# Altium schematic sheet XTIDA-010086_Power Stage.SchDoc: Power Stage (part 1 of 3)
size 558 x 431 mm; Date: Not shown in title block; ApprovedBy: Not shown in title block; CheckedBy: Not shown in title block; Author: Not shown in title block; CompanyName: Not shown in title block; DrawnBy: Jeff Xie; Engineer: Not shown in title block; Organization: Not shown in title block; Address1: Not shown in title block; Address2: Not shown in title block; Address3: Not shown in title block; Address4: Not shown in title block; DocumentNumber: 2; Revision: Use project parameter SCH_Rev; SheetNumber: 4; SheetTotal: 8; PageSetup: Record=PageOptions|CenterHorizontal=True|CenterVertical=True|PrintScale=1.00|XCorrection=1.00|YCorrection=1.00|PrintKind=0|BorderSize=5000000|LeftOffset=0|BottomOffset=0|Orientation=2|PaperLength=1000|PaperWidth=1000|Scale=100|PaperSource=15|PrintQuality=600|MediaType=1|DitherType=10|PaperKind=Letter|PrintScaleMode=1; CurrentTime: Not shown in title block; CurrentDate: Not shown in title block; Time: Not shown in title block; DocumentFullPathAndName: Not shown in title block; DocumentName: Not shown in title block; ModifiedDate: Not shown in title block; ImagePath: Not shown in title block
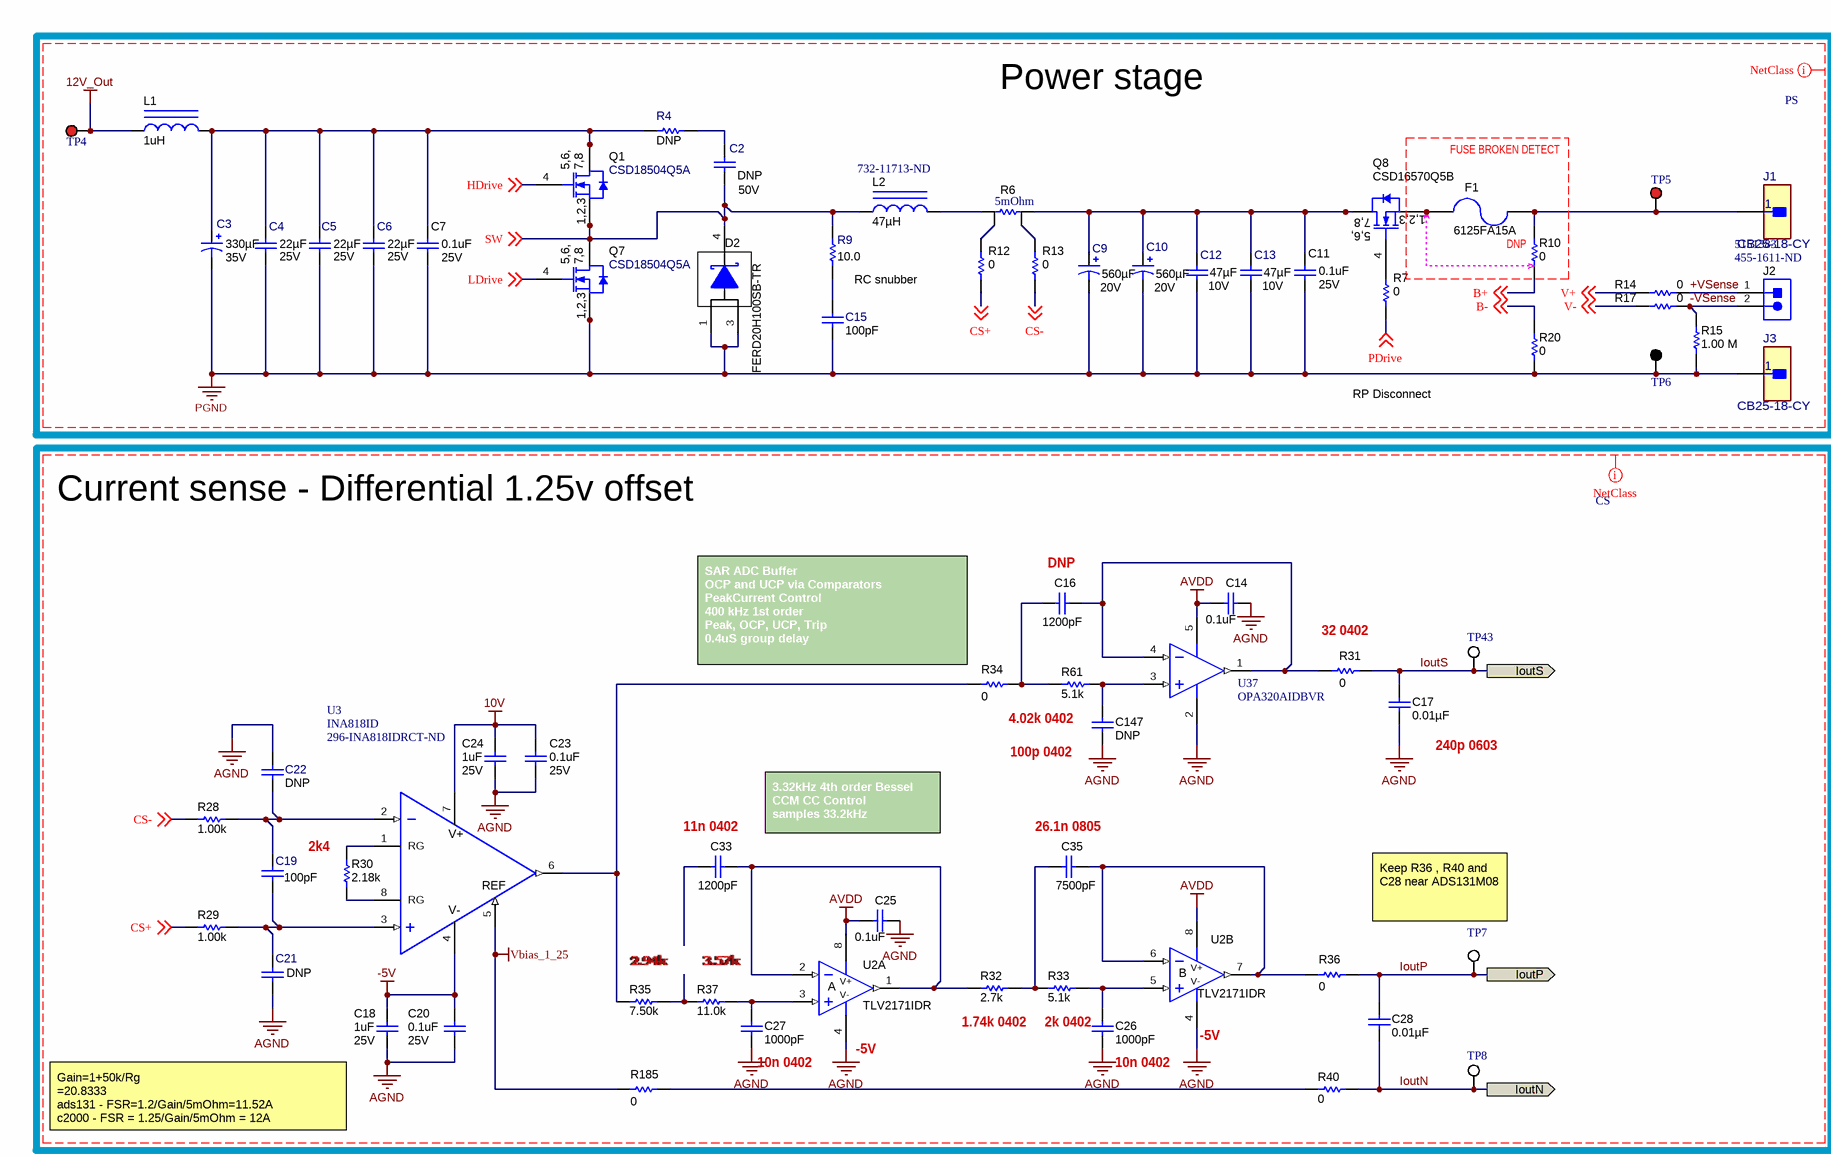
[diagram p0: XTIDA-010086_Power Stage.SchDoc, top left]
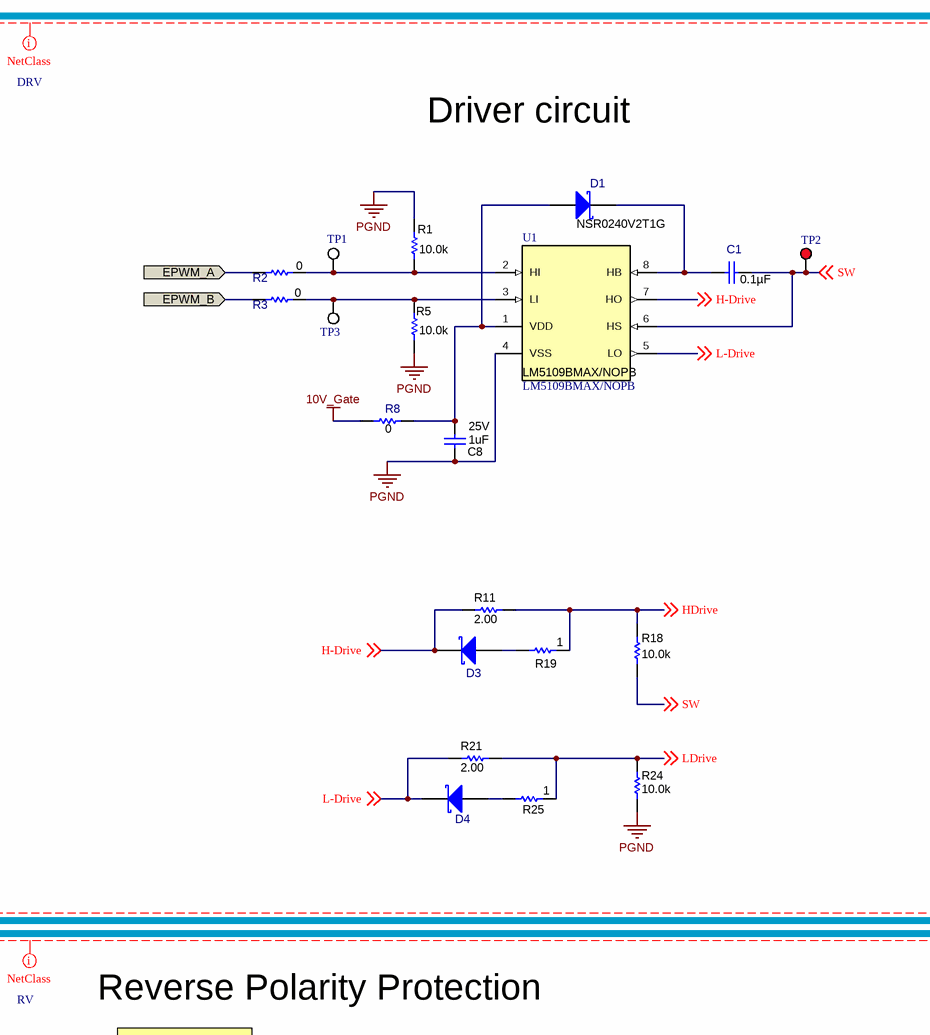
[diagram p1: XTIDA-010086_Power Stage.SchDoc, top right]
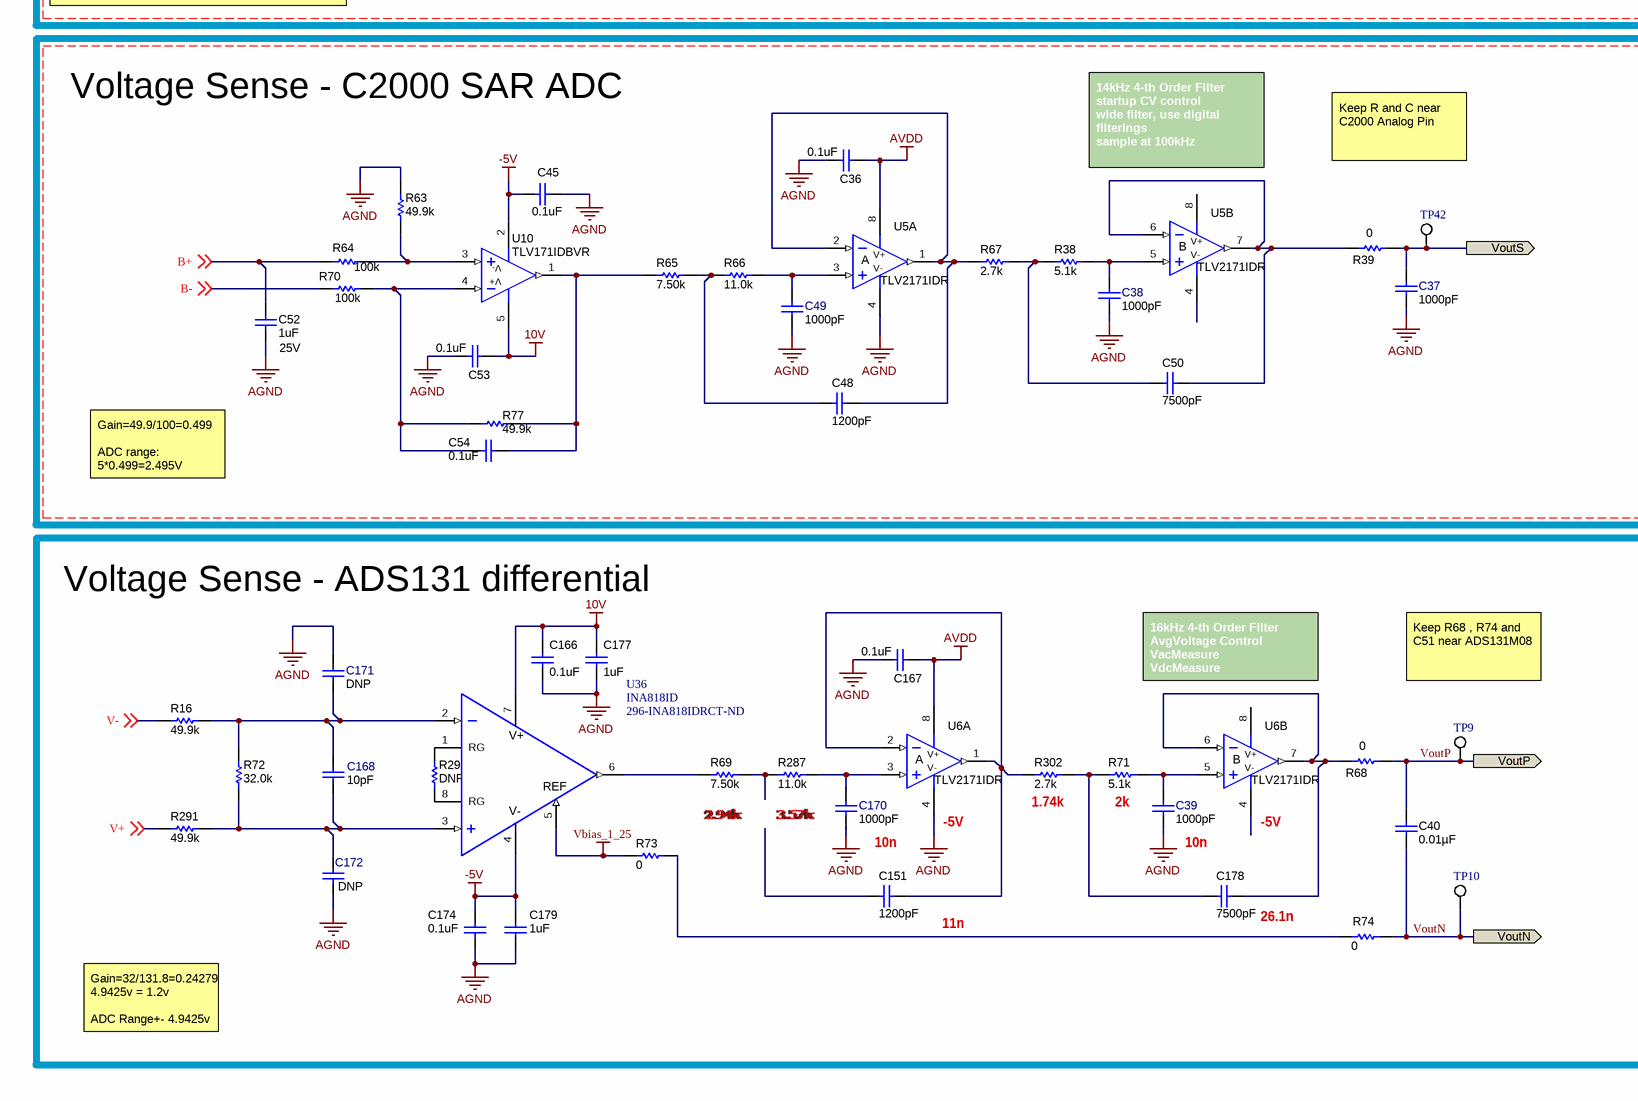
[diagram p2: XTIDA-010086_Power Stage.SchDoc, bottom left]
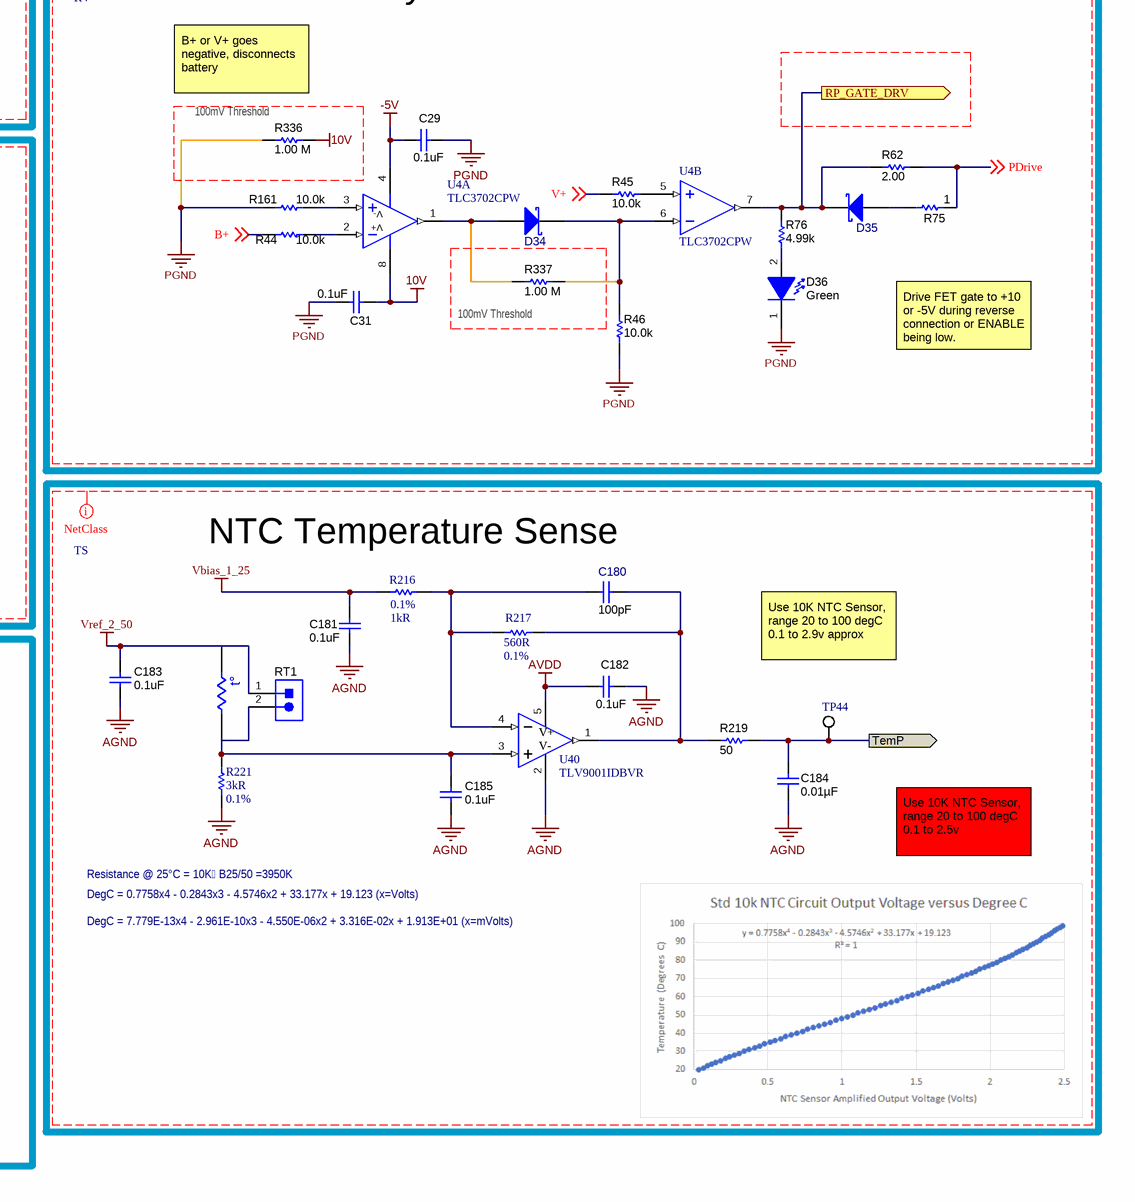
[diagram p3: XTIDA-010086_Power Stage.SchDoc, bottom right]

## Parts
(Parts that share a designator on the sheet are numbered #1, #2 ... from top to bottom, then left to right.)
C1  ValueDisplayed: 0.1µF  [0603L]  (hidden comment: C0603C104J3RACTU)
C2  ValueDisplayed: DNP  Value2: 50V  [0603L]  (hidden comment: GRM1885C1H101JA01D)
C3  ValueDisplayed: 330µF  Value2: 35V  [CAPSMT_62_F12]  (hidden comment: 35SVPK330M)
C4  ValueDisplayed: 22µF  Value2: 25V  [1210_270]  (hidden comment: GRM32ER71E226KE15L)
C5  ValueDisplayed: 22µF  Value2: 25V  [1210_270]  (hidden comment: GRM32ER71E226KE15L)
C6  ValueDisplayed: 22µF  Value2: 25V  [1210_270]  (hidden comment: GRM32ER71E226KE15L)
C7  ValueDisplayed: 0.1uF  Value2: 25V  [0603]  (hidden comment: 06033C104JAT2A)
C8  ValueDisplayed: 1uF  VDC_V: 25V  [0603]  (hidden comment: GRM188R71E105KA12D)
C9  ValueDisplayed: 560µF  Value2: 20V  [SM_RADIAL_10AMM]  (hidden comment: 20SVF560M)
C10  ValueDisplayed: 560µF  Value2: 20V  [SM_RADIAL_10AMM]  (hidden comment: 20SVF560M)
C11  ValueDisplayed: 0.1uF  Value2: 25V  [0603]  (hidden comment: 06033C104JAT2A)
C12  ValueDisplayed: 47µF  Value2: 10V  [1210_270]  (hidden comment: GRM32ER71A476ME15L)
C13  ValueDisplayed: 47µF  Value2: 10V  [1210_270]  (hidden comment: GRM32ER71A476ME15L)
C14  ValueDisplayed: 0.1uF  [0603]  (hidden comment: 06033C104JAT2A)
C15  ValueDisplayed: 100pF  [0603L]  (hidden comment: GRM1885C1H101JA01D)
C16  ValueDisplayed: 1200pF  [0402]  (hidden comment: GRM155R71H122KA01D)
C17  ValueDisplayed: 0.01µF  [0603]  (hidden comment: C0603C103J3GECAUTO)
C18  ValueDisplayed: 1uF  VDC_V: 25V  [0603]  (hidden comment: GRM188R71E105KA12D)
C19  ValueDisplayed: 100pF  [0603L]  (hidden comment: GRM1885C1H101JA01D)
C20  ValueDisplayed: 0.1uF  Value2: 25V  [0603]  (hidden comment: 06033C104JAT2A)
C21  value DNP  [0603L]  (hidden comment: GRM1885C1H101JA01D)
C22  value DNP  [0603L]  (hidden comment: GRM1885C1H101JA01D)
C23  ValueDisplayed: 0.1uF  Value2: 25V  [0603]  (hidden comment: 06033C104JAT2A)
C24  ValueDisplayed: 1uF  Value2: 25V  [0603]  (hidden comment: GRM188R71E105KA12D)
C25  ValueDisplayed: 0.1uF  [0603]  (hidden comment: 06033C104JAT2A)
C26  ValueDisplayed: 1000pF  [0402]  (hidden comment: 885012205044)
C27  ValueDisplayed: 1000pF  [0402]  (hidden comment: 885012205044)
C28  ValueDisplayed: 0.01µF  [0603]  (hidden comment: C0603C103J3GECAUTO)
C29  ValueDisplayed: 0.1uF  [0603]  (hidden comment: 06033C104JAT2A)
C31  ValueDisplayed: 0.1uF  [0603]  (hidden comment: 06033C104JAT2A)
C33  ValueDisplayed: 1200pF  [0402]  (hidden comment: GRM155R71H122KA01D)
C35  ValueDisplayed: 7500pF  [0805_HV]  (hidden comment: GRM2195C1H752JA01D)
C36  ValueDisplayed: 0.1uF  [0603]  (hidden comment: 06033C104JAT2A)
C37  ValueDisplayed: 1000pF  [0603L]  (hidden comment: GRM1885C1H102JA01D)
C38  ValueDisplayed: 1000pF  [0603L]  (hidden comment: GRM1885C1H102JA01D)
C39  ValueDisplayed: 1000pF  [0603L]  (hidden comment: GRM1885C1H102JA01D)
C40  ValueDisplayed: 0.01µF  [0603]  (hidden comment: C0603C103J3GECAUTO)
C45  ValueDisplayed: 0.1uF  [0603]  (hidden comment: 06033C104JAT2A)
C48  ValueDisplayed: 1200pF  [0402]  (hidden comment: GRM155R71H122KA01D)
C49  ValueDisplayed: 1000pF  [0603L]  (hidden comment: GRM1885C1H102JA01D)
C50  ValueDisplayed: 7500pF  [0805_HV]  (hidden comment: GRM2195C1H752JA01D)
C52  ValueDisplayed: 1uF  Value2: 25V  [0603]  (hidden comment: GRM188R71E105KA12D)
C53  ValueDisplayed: 0.1uF  [0603]  (hidden comment: 06033C104JAT2A)
C54  value 0.1uF  [0603]  (hidden comment: 06033C104JAT2A)
C147  ValueDisplayed: DNP  [0402]  (hidden comment: GRM155R71H122KA01D)
C151  ValueDisplayed: 1200pF  [0402]  (hidden comment: GRM155R71H122KA01D)
C166  ValueDisplayed: 0.1uF  [0603]  (hidden comment: 06033C104JAT2A)
C167  ValueDisplayed: 0.1uF  [0603]  (hidden comment: 06033C104JAT2A)
C168  ValueDisplayed: 10pF  [0603L]  (hidden comment: GRM1885C1H100JA01D)
C170  ValueDisplayed: 1000pF  [0603L]  (hidden comment: GRM1885C1H102JA01D)
C171  value DNP  [0603L]  (hidden comment: GRM1885C1H101JA01D)
C172  value DNP  [0603L]  (hidden comment: GRM1885C1H101JA01D)
C174  ValueDisplayed: 0.1uF  [0603]  (hidden comment: 06033C104JAT2A)
C177  ValueDisplayed: 1uF  [0603]  (hidden comment: GRM188R71E105KA12D)
C178  ValueDisplayed: 7500pF  [0805_HV]  (hidden comment: GRM2195C1H752JA01D)
C179  ValueDisplayed: 1uF  [0603]  (hidden comment: GRM188R71E105KA12D)
C180  ValueDisplayed: 100pF  [0603L]  (hidden comment: GRM1885C1H101JA01D)
C181  ValueDisplayed: 0.1uF  [0603]  (hidden comment: 06033C104JAT2A)
C182  ValueDisplayed: 0.1uF  [0603]  (hidden comment: 06033C104JAT2A)
C183  ValueDisplayed: 0.1uF  [0603]  (hidden comment: 06033C104JAT2A)
C184  ValueDisplayed: 0.01µF  [0603]  (hidden comment: C0603C103J3GECAUTO)
C185  ValueDisplayed: 0.1uF  [0603]  (hidden comment: 06033C104JAT2A)
D1  NSR0240V2T1G  [SOD-523]
D2  FERD20H100SB-TR  [DPAK]
D3  NSR0240V2T1G  [SOD-523]  (value not drawn)
D4  NSR0240V2T1G  [SOD-523]  (value not drawn)
D34  NSR0240V2T1G  [SOD-523]  (value not drawn)
D35  NSR0240V2T1G  [SOD-523]  (value not drawn)
D36  value Green  [WL-SMCW_GREEN]  (hidden comment: 150060VS75000)
F1  6125FA15A  [6125FA]
J1  CB25-18-CY  [FP-CB25-18-CY_CONN_TERM_LUG_25MM4_7MM9-MFG]
J2  Supplier Part Number 1: 455-1611-ND  Supplier Part Number 2: 5151383  [JST_B2B-EH-A]  (hidden comment: B2B-EH-A(LF)(SN))
J3  CB25-18-CY  [FP-CB25-18-CY_CONN_TERM_LUG_25MM4_7MM9-MFG]
L1  ValueDisplayed: 1uH  [WE-LHMI_4020]  (hidden comment: 74437324010)
L2  ValueDisplayed: 47µH  Supplier Part Number 1: 732-11713-ND  [WE-HCF Round_2920]  (hidden comment: 74437529203470)
Q1  CSD18504Q5A  [DQJ0008A]
Q7  CSD18504Q5A  [DQJ0008A]
Q8  CSD16570Q5B  [DNK0008A]
R1  ValueDisplayed: 10.0k  [0603]  (hidden comment: RC0603FR-0710KL)
R2  ValueDisplayed: 0  [0603L]  (hidden comment: RC0603JR-070RL)
R3  ValueDisplayed: 0  [0603L]  (hidden comment: RC0603JR-070RL)
R4  ValueDisplayed: DNP  [1206L]  (hidden comment: RC1206FR-0710RL)
R5  ValueDisplayed: 10.0k  [0603]  (hidden comment: RC0603FR-0710KL)
R6  ValueDisplayed: 5mOhm  [CSM3637Z]  (hidden comment: Y14880R00500B9R)
R7  ValueDisplayed: 0  [0402]  (hidden comment: CRCW04020000Z0ED)
R8  ValueDisplayed: 0  [0603L]  (hidden comment: RC0603JR-070RL)
R9  ValueDisplayed: 10.0  [1206L]  (hidden comment: RC1206FR-0710RL)
R10  ValueDisplayed: 0  [0402]  (hidden comment: CRCW04020000Z0ED)
R11  ValueDisplayed: 2.00  [0603]  (hidden comment: CRCW06032R00FKEA)
R12  ValueDisplayed: 0  [0402]  (hidden comment: CRCW04020000Z0ED)
R13  ValueDisplayed: 0  [0402]  (hidden comment: CRCW04020000Z0ED)
R14  ValueDisplayed: 0  [0402]  (hidden comment: CRCW04020000Z0ED)
R15  ValueDisplayed: 1.00 M  [0603]  (hidden comment: CRCW06031M00FKEA)
R16  ValueDisplayed: 49.9k  [0603]  (hidden comment: CRCW060349K9FKEA)
R17  ValueDisplayed: 0  [0402]  (hidden comment: CRCW04020000Z0ED)
R18  ValueDisplayed: 10.0k  [0603]  (hidden comment: RC0603FR-0710KL)
R19  ValueDisplayed: 1  [0603]  (hidden comment: RC0603FR-071RL)
R20  ValueDisplayed: 0  [0402]  (hidden comment: CRCW04020000Z0ED)
R21  ValueDisplayed: 2.00  [0603]  (hidden comment: CRCW06032R00FKEA)
R24  ValueDisplayed: 10.0k  [0603]  (hidden comment: RC0603FR-0710KL)
R25  ValueDisplayed: 1  [0603]  (hidden comment: RC0603FR-071RL)
R28  ValueDisplayed: 1.00k  [0603]  (hidden comment: RG1608P-102-B-T5)
R29  ValueDisplayed: 1.00k  [0603]  (hidden comment: RG1608P-102-B-T5)
R30  ValueDisplayed: 2.18k  [0603]  (hidden comment: RT0603BRD072K18L)
R31  ValueDisplayed: 0  [0402]  (hidden comment: CRCW04020000Z0ED)
R32  ValueDisplayed: 2.7k  [0402]  (hidden comment: CRCW04022K70JNED)
R33  ValueDisplayed: 5.1k  [0402]  (hidden comment: CRCW04025K10JNED)
R34  ValueDisplayed: 0  [0402]  (hidden comment: CRCW04020000Z0ED)
R35  ValueDisplayed: 7.50k  [0402]  (hidden comment: CRCW04027K50FKED)
R36  ValueDisplayed: 0  [0402]  (hidden comment: CRCW04020000Z0ED)
R37  ValueDisplayed: 11.0k  [0402]  (hidden comment: CRCW040211K0FKED)
R38  ValueDisplayed: 5.1k  [0402]  (hidden comment: CRCW04025K10JNED)
R39  ValueDisplayed: 0  [0402]  (hidden comment: CRCW04020000Z0ED)
R40  ValueDisplayed: 0  [0402]  (hidden comment: CRCW04020000Z0ED)
R44  ValueDisplayed: 10.0k  [0603]  (hidden comment: RC0603FR-0710KL)
R45  ValueDisplayed: 10.0k  [0603]  (hidden comment: RC0603FR-0710KL)
R46  ValueDisplayed: 10.0k  [0603]  (hidden comment: RC0603FR-0710KL)
R61  ValueDisplayed: 5.1k  [0402]  (hidden comment: CRCW04025K10JNED)
R62  ValueDisplayed: 2.00  [0603]  (hidden comment: CRCW06032R00FKEA)
R63  ValueDisplayed: 49.9k  [0603]  (hidden comment: CRCW060349K9FKEA)
R64  ValueDisplayed: 100k  [0603]  (hidden comment: RT0603BRD07100KL)
R65  ValueDisplayed: 7.50k  [0402]  (hidden comment: CRCW04027K50FKED)
R66  ValueDisplayed: 11.0k  [0402]  (hidden comment: CRCW040211K0FKED)
R67  ValueDisplayed: 2.7k  [0402]  (hidden comment: CRCW04022K70JNED)
R68  ValueDisplayed: 0  [0402]  (hidden comment: CRCW04020000Z0ED)
R69  ValueDisplayed: 7.50k  [0402]  (hidden comment: CRCW04027K50FKED)
R70  ValueDisplayed: 100k  [0603]  (hidden comment: RT0603BRD07100KL)
R71  ValueDisplayed: 5.1k  [0402]  (hidden comment: CRCW04025K10JNED)
R72  ValueDisplayed: 32.0k  [0603]  (hidden comment: RN731JTTD3202B25)
R73  ValueDisplayed: 0  [0402]  (hidden comment: CRCW04020000Z0ED)
R74  ValueDisplayed: 0  [0402]  (hidden comment: CRCW04020000Z0ED)
R75  ValueDisplayed: 1  [0603]  (hidden comment: RC0603FR-071RL)
R76  ValueDisplayed: 4.99k  [0603L]  (hidden comment: CRCW06034K99FKEA)
R77  ValueDisplayed: 49.9k  [0603]  (hidden comment: CRCW060349K9FKEA)
R161  ValueDisplayed: 10.0k  [0603]  (hidden comment: RC0603FR-0710KL)
R185  ValueDisplayed: 0  [0402]  (hidden comment: CRCW04020000Z0ED)
R216  Tolerance: 0.1%  Resistance: 1kR  [RESC1608X55X25ML10T15]  (hidden comment: RT0603BRE071KL)
R217  Resistance: 560R  Tolerance: 0.1%  [RESC1608X55X25LL10T15]  (hidden comment: RT0603BRD07560RL)
R219  ValueDisplayed: 50  [0402]  (hidden comment: FC0402E50R0BST1)
R221  Resistance: 3kR  Tolerance: 0.1%  [RESC1608X55X30NL20T20]  (hidden comment: ERA-3YEB302V)
R287  ValueDisplayed: 11.0k  [0402]  (hidden comment: CRCW040211K0FKED)
R290  ValueDisplayed: DNP  [0402]  (hidden comment: CRCW04020000Z0ED)
R291  ValueDisplayed: 49.9k  [0603]  (hidden comment: CRCW060349K9FKEA)
R302  ValueDisplayed: 2.7k  [0402]  (hidden comment: CRCW04022K70JNED)
R336  ValueDisplayed: 1.00 M  [0603]  (hidden comment: CRCW06031M00FKEA)
R337  ValueDisplayed: 1.00 M  [0603]  (hidden comment: CRCW06031M00FKEA)
RT1#1  B2B-EH-A(LF)(SN)  [JST_B2B-EH-A]  (value not drawn)
RT1#2  Res Thermal  [JST_B2B-EH-A]  (value not drawn)  (graphical)
TP1  5002  [Keystone5002]  (value not drawn)
TP2  5000  [Keystone5000]  (value not drawn)
TP3  5002  [Keystone5002]  (value not drawn)
TP4  5000  [Keystone5000]  (value not drawn)
TP5  5000  [Keystone5000]  (value not drawn)
TP6  5001  [Keystone5001]  (value not drawn)
TP7  5002  [Keystone5002]  (value not drawn)
TP8  5002  [Keystone5002]  (value not drawn)
TP9  5002  [Keystone5002]  (value not drawn)
TP10  5002  [Keystone5002]  (value not drawn)
TP42  5002  [Keystone5002]  (value not drawn)
TP43  5002  [Keystone5002]  (value not drawn)
TP44  5002  [Keystone5002]  (value not drawn)
U1  LM5109BMAX/NOPB  [D0008A_N]
U2  TLV2171IDR  [D0008A_N]  (parts A,B of 2)
U3  INA818ID  Supplier Part Number 1: 296-INA818IDRCT-ND  [SOIC-8_TEX]
U4  TLC3702CPW  [PW8-L]  (parts A,B of 2)
U5  TLV2171IDR  [D0008A_N]  (parts A,B of 2)
U6  TLV2171IDR  [D0008A_N]  (parts A,B of 2)
U10  TLV171IDBVR  [DBV0005A_N]
U36  INA818ID  Supplier Part Number 1: 296-INA818IDRCT-ND  [SOIC-8_TEX]
U37  OPA320AIDBVR  [DBV0005A_L]
U40  TLV9001IDBVR  [DBV0005A_L]

## Blocks framed on the sheet
Power stage: C2-C7 C9-C13 C15 D2 F1 J1-J3 L1 L2 Q1 Q7 Q8 R4 R6 R7 R9 R10 R12-R15 R17 R20 TP4-TP6
Driver circuit: C1 C8 D1 D3 D4 R1-R3 R5 R8 R11 R18 R19 R21 R24 R25 TP1-TP3 U1
Current sense - Differential 1.25v offset: C14 C16-C28 C33 C35 C147 R28-R37 R40 R61 R185 TP7 TP8 TP43 U2 U3 U37
Reverse Polarity Protection: C29 C31 D34-D36 R44-R46 R62 R75 R76 R161 R336 R337 U4
Voltage Sense - C2000 SAR ADC: C36-C38 C45 C48-C50 C52-C54 R38 R39 R63-R67 R70 R77 TP42 U5 U10
NTC Temperature Sense: C180-C185 R216 R217 R219 R221 RT1#1 RT1#2 TP44 U40
Voltage Sense - ADS131 differential: C39 C40 C151 C166-C168 C170-C172 C174 C177-C179 R16 R68 R69 R71-R74 R287 R290 R291 R302 TP9 TP10 U6 U36

## Ports
EPWM_A (in), EPWM_B (in), IoutN (out), IoutP (out), IoutS (out), RP_GATE_DRV (out), TemP (out), VoutN (out), VoutP (out), VoutS (out)

## Nets
10V: C23.1 C24.1 C31.1 C53.1 C166.1 C177.1 R336.2 U3.7(V+) U4.8(VDD) U10.5(V+) U36.7(V+)
10V_Gate: R8.2
12V_Out: L1.1 TP4.1
-5V: C18.1 C20.1 C29.1 C45.1 C174.1 C179.1 U3.4(V-) U4.4(GND) U10.2(V-) U36.4(V-)
AGND: C14.2 C17.2 C18.2 C20.2 C21.1 C22.2 C23.2 C24.2 C25.2 C26.2 C27.2 C36.2 C37.1 C38.1 C39.1 C45.2 C49.1 C52.2 C53.2 C147.2 C166.2 C167.2 C170.1 C171.2 C172.2 C174.2 C177.2 C179.2 C181.1 C182.2 C183.1 C184.2 C185.1 R63.2 R221.1 U2.4(V-) U5.4(V-) U6.4(V-) U37.2(V-) U40.2(V-)
AVDD: C14.1 C25.1 C36.1 C167.1 C182.1 U2.8(V+) U5.8(V+) U6.8(V+) U37.5(V+) U40.5(V+)
PGND: C3.2(-) C4.2 C5.2 C6.2 C7.2 C8.1 C9.2(-) C10.2(-) C11.2 C12.2 C13.2 C15.1 C29.2 C31.2 D2.1(A) D2.3(A) D36.1(K) J3.1 Q7.1(S) Q7.2(S) Q7.3(S) R1.2 R5.1 R15.2 R20.1 R24.1 R46.2 R161.2 R336.1 TP6.1 U1.4(VSS)
Vbias_1_25: C181.2 R73.2 R185.2 R216.1 U3.5(REF) U36.5(REF)
Vref_2_50: C183.2 RT1#1.1 RT1#2.1
+VSense: J2.1 R14.2
-VSense: J2.2 R15.1 R17.2
B+: C52.1 R10.1 R44.2 R64.1 ; off-sheet B+
B-: R20.2 R70.1 ; off-sheet B-
CS+: R12.1 R29.1 ; off-sheet CS+
CS-: R13.1 R28.1 ; off-sheet CS-
EPWM_A: R2.2 ; port EPWM_A
EPWM_B: R3.2 ; port EPWM_B
H-Drive: D3.1(K) R11.2 U1.7(HO) ; off-sheet H-Drive
HDrive: Q1.4(G) R11.1 R18.2 R19.2 ; off-sheet HDrive
IoutN: C28.2 R40.1 TP8.1 ; port IoutN
IoutP: C28.1 R36.2 TP7.1 ; port IoutP
IoutS: C17.1 R31.2 TP43.1 ; port IoutS
L-Drive: D4.1(K) R21.2 U1.5(LO) ; off-sheet L-Drive
LDrive: Q7.4(G) R21.1 R24.2 R25.2 ; off-sheet LDrive
PDrive: R7.1 R62.1 R75.2 ; off-sheet PDrive
RP_GATE_DRV: D35.1(K) R62.2 R76.1 U4.7(2OUT) ; port RP_GATE_DRV
SW: C1.2 C2.1 D2.4(K) L2.1 Q1.1(S) Q1.2(S) Q1.3(S) Q7.5(D) Q7.6(D) Q7.7(D) Q7.8(D) Q7.9(D) R9.1 R18.1 TP2.1 U1.6(HS) ; off-sheet SW
TemP: C184.1 R219.2 TP44.1 ; port TemP
V+: R14.1 R45.2 R291.2 ; off-sheet V+
V-: R16.2 R17.1 ; off-sheet V-
VoutN: C40.2 R74.1 TP10.1 ; port VoutN
VoutP: C40.1 R68.2 TP9.1 ; port VoutP
VoutS: C37.2 R39.2 TP42.1 ; port VoutS
NetC1_1: C1.1 D1.1(K) U1.8(HB)
NetC2_2: C2.2 R4.2
NetC3_1: C3.1(+) C4.1 C5.1 C6.1 C7.1 L1.2 Q1.5(D) Q1.6(D) Q1.7(D) Q1.8(D) Q1.9(D) R4.1
NetC8_2: C8.2 D1.2(A) R8.1 U1.1(VDD)
NetC9_1: C9.1(+) C10.1(+) C11.1 C12.1 C13.1 Q8.5(D) Q8.6(D) Q8.7(D) Q8.8(D) Q8.9(D) R6.1
NetC15_2: C15.2 R9.2
NetC16_1: C16.1 R31.1 U37.1(OUT) U37.4(IN-)
NetC16_2: C16.2 R34.2 R61.1
NetC19_1: C19.1 C22.1 R28.2 U3.2(IN-)
NetC19_2: C19.2 C21.2 R29.2 U3.3(IN+)
NetC26_1: C26.1 R33.2 U2.5(IN+)
NetC27_1: C27.1 R37.2 U2.3(IN+)
NetC33_1: C33.1 R32.1 U2.1(OUT) U2.2(IN-)
NetC33_2: C33.2 R35.2 R37.1
NetC35_1: C35.1 R36.1 U2.6(IN-) U2.7(OUT)
NetC35_2: C35.2 R32.2 R33.1
NetC38_2: C38.2 R38.2 U5.5(IN+)
NetC39_2: C39.2 R71.2 U6.5(IN+)
NetC48_1: C48.1 R67.1 U5.1(OUT) U5.2(IN-)
NetC48_2: C48.2 R65.2 R66.1
NetC49_2: C49.2 R66.2 U5.3(IN+)
NetC50_1: C50.1 R39.1 U5.6(IN-) U5.7(OUT)
NetC50_2: C50.2 R38.1 R67.2
NetC54_1: C54.1 R70.2 R77.1 U10.4(IN-)
NetC54_2: C54.2 R65.1 R77.2 U10.1(OUT)
NetC147_1: C147.1 R61.2 U37.3(IN+)
NetC151_1: C151.1 R302.1 U6.1(OUT) U6.2(IN-)
NetC151_2: C151.2 R69.2 R287.1
NetC168_1: C168.1 C171.1 R16.1 R72.2 U36.2(IN-)
NetC168_2: C168.2 C172.1 R72.1 R291.1 U36.3(IN+)
NetC170_2: C170.2 R287.2 U6.3(IN+)
NetC178_1: C178.1 R68.1 U6.6(IN-) U6.7(OUT)
NetC178_2: C178.2 R71.1 R302.2
NetC180_1: C180.1 R216.2 R217.1 U40.4(IN-)
NetC180_2: C180.2 R217.2 R219.1 U40.1(OUT)
NetC185_2: C185.2 R221.2 RT1#1.2 RT1#2.2 U40.3(IN+)
NetD3_2: D3.2(A) R19.1
NetD4_2: D4.2(A) R25.1
NetD34_1: D34.1(K) R46.1 R337.2 U4.6(2IN-)
NetD34_2: D34.2(A) R337.1 U4.1(1OUT)
NetD35_2: D35.2(A) R75.1
NetD36_2: D36.2(A) R76.2
NetF1_1: F1.1 J1.1 R10.2 TP5.1
NetF1_2: F1.2 Q8.1(S) Q8.2(S) Q8.3(S)
NetL2_2: L2.2 R6.2
NetQ8_4: Q8.4(G) R7.2
NetR1_1: R1.1 R2.1 TP1.1 U1.2(HI)
NetR3_1: R3.1 R5.2 TP3.1 U1.3(LI)
NetR6_3: R6.3 R13.2
NetR6_4: R6.4 R12.2
NetR30_1: R30.1 U3.8(RG)
NetR30_2: R30.2 U3.1(RG)
NetR34_1: R34.1 R35.1 U3.6(OUT)
NetR40_2: R40.2 R185.1
NetR44_1: R44.1 U4.2(1IN-)
NetR45_1: R45.1 U4.5(2IN+)
NetR63_1: R63.1 R64.2 U10.3(IN+)
NetR69_1: R69.1 U36.6(OUT)
NetR73_1: R73.1 R74.2
NetR161_1: R161.1 U4.3(1IN+)
NetR290_1: R290.1 U36.1(RG)
NetR290_2: R290.2 U36.8(RG)

## Layout directives
net class PS: 12V_Out, +VSense, -VSense, B+, B-, CS+, CS-, HDrive, LDrive, PDrive, PGND, SW, V+, V-
net class DRV: 10V_Gate, H-Drive, HDrive, L-Drive, LDrive, PGND, SW
net class RV; Group: RV: 10V, -5V, B+, PDrive, PGND, V+
net class TS; Group: TS: AGND, AVDD, Vbias_1_25, Vref_2_50
net class ACS: 10V, -5V, AGND, AVDD, B+, B-
net class CS: 10V, -5V, AGND, AVDD, CS+, CS-, IoutN, IoutP, IoutS, Vbias_1_25

## Notes on the sheet
- FUSE BROKEN DETECT
- RC snubber
- (near R10) DNP
- RP Disconnect
- (near C16) DNP
- (near R31) 32 0402
- (near R34) SAR ADC Buffer
  OCP and UCP via Comparators
  PeakCurrent Control
  400 kHz 1st order
  Peak, OCP, UCP, Trip
  0.4uS group delay
- 4.02k 0402
- (near C147) 100p 0402
- (near C17) 240p 0603
- (near C33) 11n 0402
- (near C33) 3.32kHz 4th order Bessel CCM CC Control
  samples 33.2kHz
- (near C35) 26.1n 0805
- (near R30) 2k4
- Keep R36 , R40 and C28 near ADS131M08
- 1.74k 0402
- (near C26) 2k 0402
- (near U2) -5V
- (near C27) 10n 0402
- (near C26) 10n 0402
- (near C18) Gain=1+50k/Rg
  =20.8333
  ads131 - FSR=1.2/Gain/5mOhm=11.52A
  c2000 - FSR = 1.25/Gain/5mOhm = 12A
- (near R336) B+ or V+ goes negative, disconnects battery
- (near R336) 100mV Threshold
- 14kHz 4-th Order Filter
  startup CV control
  wide filter, use digital filterings
  sample at 100kHz
- Keep R and C near C2000 Analog Pin
- (near R337) 100mV Threshold
- Drive FET gate to +10 or -5V during reverse connection or ENABLE being low.
- Gain=49.9/100=0.499
  ADC range: 5*0.499=2.495V
- Use 10K NTC Sensor, range 20 to 100 degC 0.1 to 2.9v approx
- 16kHz 4-th Order Filter
  AvgVoltage Control
  VacMeasure
  VdcMeasure
- Keep R68 , R74 and C51 near ADS131M08
- Resistance @ 25°C = 10K B25/50 =3950K
- Use 10K NTC Sensor, range 20 to 100 degC 0.1 to 2.5v
- 10n
- (near U6) -5V
- (near R302) 1.74k
- (near R71) 2k
- DegC = 0.7758x4 - 0.2843x3 - 4.5746x2 + 33.177x + 19.123 (x=Volts)
- DegC = 7.779E-13x4 - 2.961E-10x3 - 4.550E-06x2 + 3.316E-02x + 1.913E+01 (x=mVolts)
- (near C151) 11n
- (near C178) 26.1n
- Gain=32/131.8=0.24279
  4.9425v = 1.2v
  ADC Range+- 4.9425v
- Drawn By:
- SVN Rev:
- Number:
- TID #:
- Orderable:
- Rev:
- Sheet Title:
- File:
- Project Title:
- Designed for:
- Assembly Variant:
- Mod. Date:
- Sheet:
- Size:
- of
- C
- http://www.ti.com
- Texas Instruments and/or its licensors do not warrant the accuracy or completeness of this specification or any information contained therein. Texas Instruments and/or its licensors do not warrant that this design will meet the specifications, will be suitable for your application or fit for any particular purpose, or will operate in an implementation. Texas Instruments and/or its licensors do not warrant that the design is production worthy. You should completely validate and test your design implementation to confirm the system functionality for your application.
- Engineer:
- Contact:
- © Texas Instruments
- (in symbol CSD16570Q5B) 7,8; 1,2,3; 5,6,
- (in symbol MOSFET_N_D56789G4S123) 5,6,; 7,8; 1,2,3
- (in symbol Opamp_Dual, part A) A
- (in symbol Opamp_Dual, part B) B
- (in symbol Res Thermal) t°
- (in symbol TLC3702CPW, part A) V-; V+